# EasyEDA schematic SCH_TRSID_2026-05-11.json
TITLE: Sheet_1; REV: 1.0; Date: 2026-05-11; Sheet: 1/1; Drawn By: chengyanyang0510; Company: Your Company
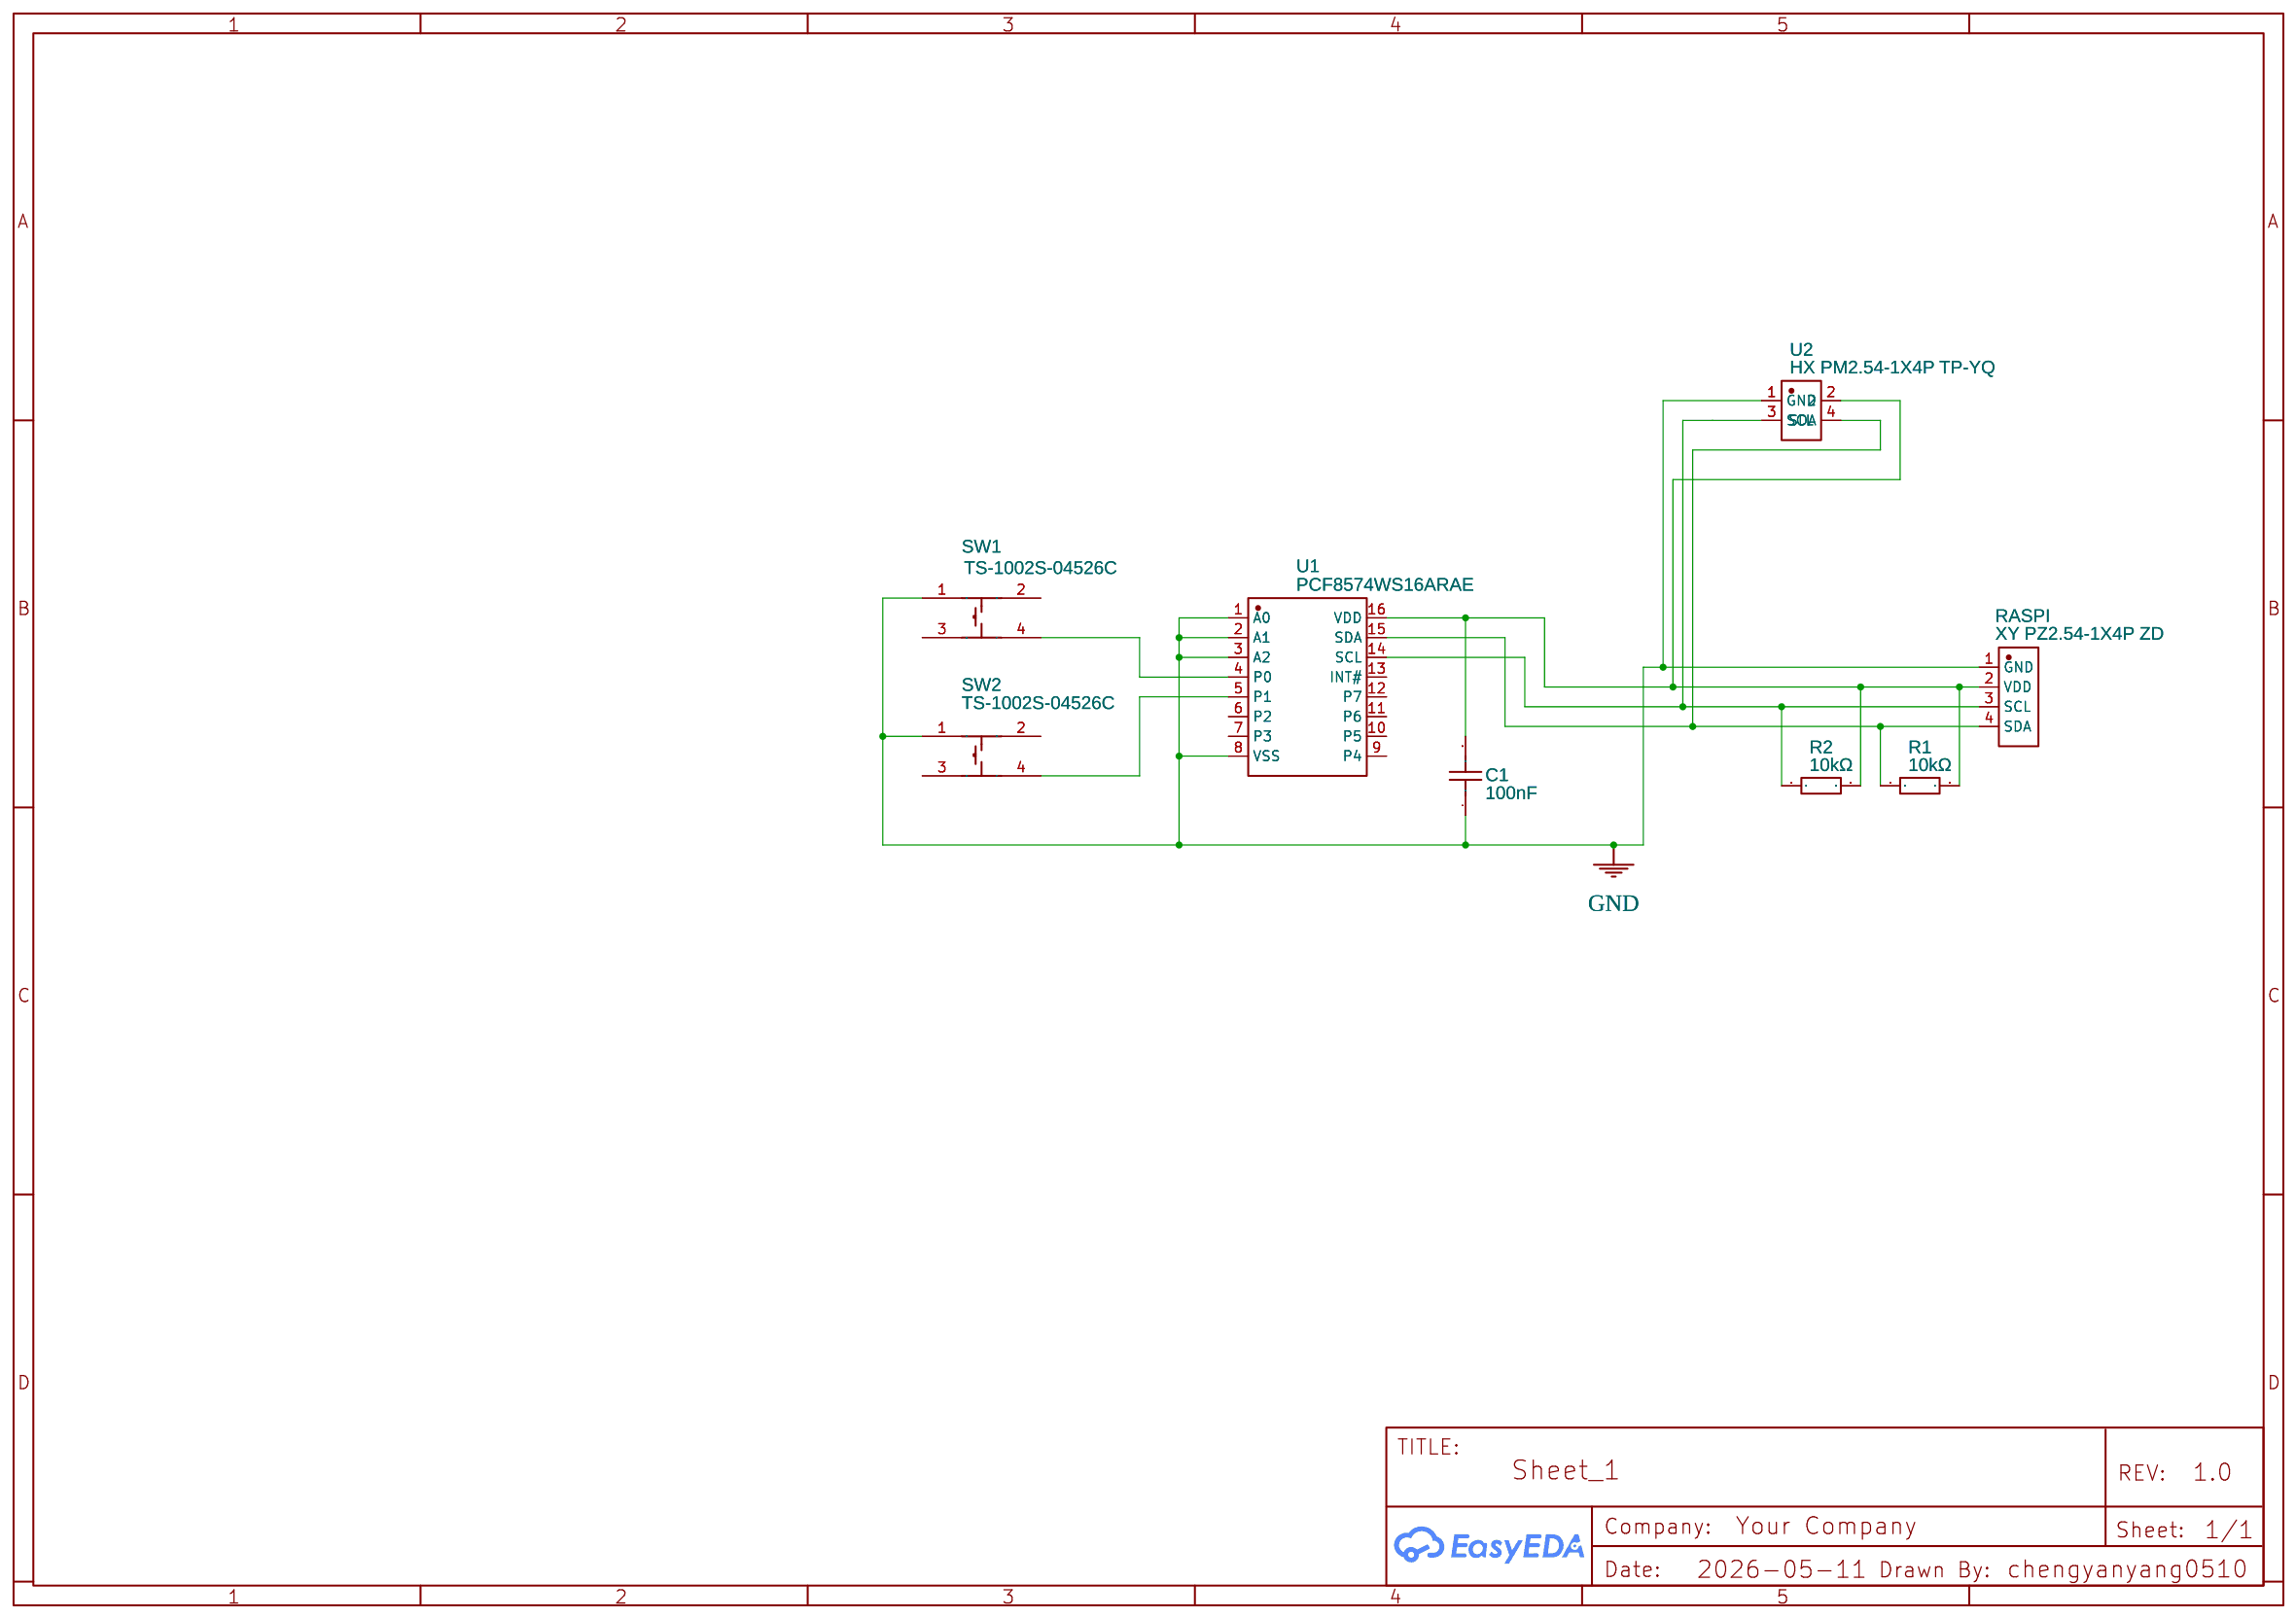
[diagram p0: schematic sheet]

## Parts
C1  100nF  [C0402]
R1  10kΩ  [R1206]
R2  10kΩ  [R1206]
RASPI  XY PZ2.54-1X4P ZD  [CONN-TH_PZ2.54-1X4-11.2]
SW1  TS-1002S-04526C  [SW-SMD_4P-L6.0-W6.0-P4.50-LS9.0-2]
SW2  TS-1002S-04526C  [SW-SMD_4P-L6.0-W6.0-P4.50-LS9.0-2]
U1  PCF8574WS16ARAE  [SOP-16_L10.3-W7.5-P1.27-LS10.3-BL]
U2  HX PM2.54-1X4P TP-YQ  [HDR-SMD_HX-PM2.54-1X4P-TP-YQ]

## Library data of the parts
C1 = CL05B104KO5NNNC: Supplier: LCSC; Manufacturer: SAMSUNG(三星); Supplier Part: C1525; JLCPCB Part Class: Basic Part
R1 R2 = 1206W4F1002T5E: Supplier: LCSC; Manufacturer: UNI-ROYAL(厚声); Supplier Part: C17902; JLCPCB Part Class: Basic Part
RASPI = XY PZ2.54-1X4P ZD: Supplier: LCSC; Supplier Part: C54110161; Manufacturer: XYECONN(辛译); Manufacturer Part: XY PZ2.54-1x4P ZD; JLCPCB Part Class: Extended Part; Contributor: lcsc
SW1 SW2 = TS-1002S-04526C: Contributor: LCSC; Supplier: LCSC; Supplier Part: C455109; Manufacturer: XUNPU(讯普); JLCPCB Part Class: Extended Part
U1 = PCF8574WS16ARAE: Supplier: LCSC; Supplier Part: C49443602; Manufacturer: GR(国睿); Contributor: lcsc; JLCPCB Part Class: Extended Part
U2 = HX PM2.54-1X4P TP-YQ: Supplier: LCSC; Supplier Part: C42379197; Manufacturer: hanxia(韩下); Manufacturer Part: HX PM2.54-1x4P TP-YQ; JLCPCB Part Class: Extended Part; Contributor: lcsc

## Nets
GND: C1.1 RASPI.1(GND) SW1.1 SW2.1 U1.1(A0) U1.2(A1) U1.3(A2) U1.8(VSS) U2.1(GND)
Net-(C1-2): C1.2 R1.2 R2.2 RASPI.2(VDD) U1.16(VDD) U2.2
Net-(R1-1): R1.1 RASPI.4(SDA) U1.15(SDA) U2.4(SDA)
Net-(R2-1): R2.1 RASPI.3(SCL) U1.14(SCL) U2.3(SCL)
Net-(SW1-4): SW1.4 U1.4(P0)
Net-(SW2-4): SW2.4 U1.5(P1)

Not connected (* = marked no-connect by the designer): SW1 2 3; SW2 2 3; U1 6(P2) 7(P3) 9(P4) 10(P5) 11(P6) 12(P7) 13(INT#)
